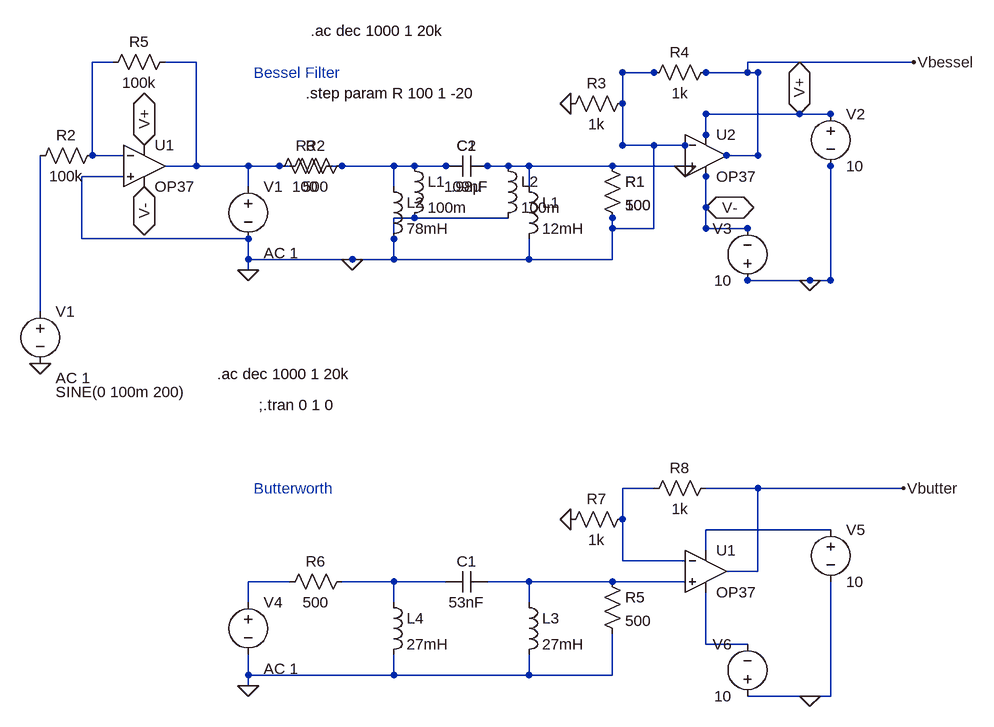
[diagram p0: schematic HighPass.asc]
HighPass.asc, the LTspice schematic file:
Version 4
<<<<<<< HEAD
SHEET 1 1036 680
WIRE -128 112 -160 112
WIRE 0 112 -48 112
WIRE 704 128 656 128
WIRE 864 128 784 128
WIRE 928 192 784 192
WIRE 976 192 928 192
WIRE 784 224 784 192
WIRE 656 240 656 128
WIRE 704 240 656 240
WIRE 752 240 704 240
WIRE -160 256 -160 112
WIRE -112 256 -160 256
WIRE 864 256 864 128
WIRE 864 256 816 256
WIRE 0 272 0 112
WIRE 0 272 -48 272
WIRE 128 272 0 272
WIRE 336 272 208 272
WIRE 384 272 336 272
WIRE 480 272 448 272
WIRE 640 272 480 272
WIRE -112 288 -176 288
WIRE 784 336 784 288
WIRE 336 352 304 352
WIRE 480 352 336 352
WIRE 640 368 640 352
WIRE 704 368 704 240
WIRE 704 368 640 368
WIRE 784 368 784 336
WIRE 848 368 784 368
WIRE -176 384 -176 288
WIRE 80 384 -176 384
WIRE 80 416 80 384
WIRE 240 416 80 416
WIRE 304 416 304 352
WIRE 304 416 240 416
WIRE 944 448 848 448
WIRE 976 448 976 272
WIRE 976 448 944 448
WIRE -240 496 -240 256
FLAG 240 416 0
FLAG 944 448 0
FLAG 928 192 V+
IOPIN 928 192 BiDir
FLAG 784 336 V-
IOPIN 784 336 BiDir
FLAG -80 240 V+
IOPIN -80 240 BiDir
FLAG -80 304 V-
IOPIN -80 304 BiDir
FLAG -240 576 0
FLAG 752 272 0
SYMBOL res 624 256 R0
SYMATTR InstName R1
SYMATTR Value 100
=======
SHEET 1 1200 1104
WIRE 1104 112 848 112
WIRE 704 128 656 128
WIRE 848 128 848 112
WIRE 848 128 784 128
WIRE 864 128 848 128
WIRE 656 176 656 128
WIRE 976 192 784 192
WIRE 784 224 784 192
WIRE 656 240 656 176
WIRE 752 240 656 240
WIRE 864 256 864 128
WIRE 864 256 816 256
WIRE 144 272 80 272
WIRE 304 272 224 272
WIRE 384 272 304 272
WIRE 512 272 448 272
WIRE 640 272 512 272
WIRE 752 272 640 272
WIRE 80 304 80 272
WIRE 304 304 304 272
WIRE 512 304 512 272
WIRE 784 368 784 288
WIRE 848 368 784 368
WIRE 80 416 80 384
WIRE 304 416 304 384
WIRE 304 416 80 416
WIRE 512 416 512 384
WIRE 512 416 304 416
WIRE 640 416 640 352
WIRE 640 416 512 416
WIRE 80 432 80 416
WIRE 944 448 848 448
WIRE 976 448 976 272
WIRE 976 448 944 448
WIRE 704 768 656 768
WIRE 864 768 784 768
WIRE 1088 768 864 768
WIRE 656 816 656 768
WIRE 976 832 784 832
WIRE 784 864 784 832
WIRE 656 880 656 816
WIRE 752 880 656 880
WIRE 864 896 864 768
WIRE 864 896 816 896
WIRE 144 912 80 912
WIRE 304 912 224 912
WIRE 384 912 304 912
WIRE 512 912 448 912
WIRE 640 912 512 912
WIRE 752 912 640 912
WIRE 80 944 80 912
WIRE 304 944 304 912
WIRE 512 944 512 912
WIRE 784 1008 784 928
WIRE 848 1008 784 1008
WIRE 80 1056 80 1024
WIRE 304 1056 304 1024
WIRE 304 1056 80 1056
WIRE 512 1056 512 1024
WIRE 512 1056 304 1056
WIRE 640 1056 640 992
WIRE 640 1056 512 1056
WIRE 80 1072 80 1056
WIRE 944 1088 848 1088
WIRE 976 1088 976 912
WIRE 976 1088 944 1088
FLAG 80 432 0
FLAG 576 176 0
FLAG 944 448 0
FLAG 80 1072 0
FLAG 576 816 0
FLAG 944 1088 0
FLAG 1104 112 Vbessel
FLAG 1088 768 Vbutter
SYMBOL cap 448 256 R90
WINDOW 0 0 32 VBottom 2
WINDOW 3 32 32 VTop 2
SYMATTR InstName C2
SYMATTR Value 109nF
SYMBOL ind 496 288 R0
SYMATTR InstName L1
SYMATTR Value 12mH
SYMBOL res 624 256 R0
SYMATTR InstName R1
SYMATTR Value 500
SYMBOL res 128 288 R270
WINDOW 0 32 56 VTop 2
WINDOW 3 0 56 VBottom 2
SYMATTR InstName R2
SYMATTR Value 500
SYMBOL voltage 80 288 R0
WINDOW 123 24 118 Left 2
SYMATTR Value2 AC 1
SYMATTR InstName V1
SYMATTR Value ""
SYMBOL res 560 192 R270
WINDOW 0 32 56 VTop 2
WINDOW 3 0 56 VBottom 2
SYMATTR InstName R3
SYMATTR Value 1k
>>>>>>> origin/master
SYMBOL res 688 144 R270
WINDOW 0 32 56 VTop 2
WINDOW 3 0 56 VBottom 2
SYMATTR InstName R4
<<<<<<< HEAD
SYMATTR Value {R}
=======
SYMATTR Value 1k
>>>>>>> origin/master
SYMBOL Opamps/OP37 784 192 R0
SYMATTR InstName U2
SYMBOL voltage 976 176 R0
SYMATTR InstName V2
SYMATTR Value 10
SYMBOL voltage 848 464 R180
WINDOW 0 24 96 Left 2
WINDOW 3 24 16 Left 2
SYMATTR InstName V3
SYMATTR Value 10
<<<<<<< HEAD
SYMBOL Opamps/OP37 -80 208 R0
SYMATTR InstName U1
SYMBOL res -144 240 R90
WINDOW 0 0 56 VBottom 2
WINDOW 3 32 56 VTop 2
SYMATTR InstName R2
SYMATTR Value 100k
SYMBOL res -32 96 R90
WINDOW 0 0 56 VBottom 2
WINDOW 3 32 56 VTop 2
SYMATTR InstName R5
SYMATTR Value 100k
SYMBOL voltage -240 480 R0
WINDOW 3 24 140 Left 2
WINDOW 123 24 118 Left 2
SYMATTR Value SINE(0 100m 200)
SYMATTR Value2 AC 1
SYMATTR InstName V1
SYMBOL cap 448 256 R90
WINDOW 0 0 32 VBottom 2
WINDOW 3 32 32 VTop 2
SYMATTR InstName C1
SYMATTR Value .98µ
SYMBOL ind 320 256 R0
SYMATTR InstName L1
SYMATTR Value 100m
SYMBOL ind 464 256 R0
SYMATTR InstName L2
SYMATTR Value 100m
SYMBOL res 224 256 R90
WINDOW 0 0 56 VBottom 2
WINDOW 3 32 56 VTop 2
SYMATTR InstName R3
SYMATTR Value 100
TEXT 176 64 Left 2 !.ac dec 1000 1 20k
TEXT 96 640 Left 2 !;.tran 0 1 0
TEXT 168 160 Left 2 !.step param R 100 1 -20
=======
SYMBOL ind 288 288 R0
SYMATTR InstName L2
SYMATTR Value 78mH
SYMBOL cap 448 896 R90
WINDOW 0 0 32 VBottom 2
WINDOW 3 32 32 VTop 2
SYMATTR InstName C1
SYMATTR Value 53nF
SYMBOL ind 496 928 R0
SYMATTR InstName L3
SYMATTR Value 27mH
SYMBOL res 624 896 R0
SYMATTR InstName R5
SYMATTR Value 500
SYMBOL res 128 928 R270
WINDOW 0 32 56 VTop 2
WINDOW 3 0 56 VBottom 2
SYMATTR InstName R6
SYMATTR Value 500
SYMBOL voltage 80 928 R0
WINDOW 123 24 118 Left 2
SYMATTR Value2 AC 1
SYMATTR InstName V4
SYMATTR Value ""
SYMBOL res 560 832 R270
WINDOW 0 32 56 VTop 2
WINDOW 3 0 56 VBottom 2
SYMATTR InstName R7
SYMATTR Value 1k
SYMBOL res 688 784 R270
WINDOW 0 32 56 VTop 2
WINDOW 3 0 56 VBottom 2
SYMATTR InstName R8
SYMATTR Value 1k
SYMBOL Opamps/OP37 784 832 R0
SYMATTR InstName U1
SYMBOL voltage 976 816 R0
SYMATTR InstName V5
SYMATTR Value 10
SYMBOL voltage 848 1104 R180
WINDOW 0 24 96 Left 2
WINDOW 3 24 16 Left 2
SYMATTR InstName V6
SYMATTR Value 10
SYMBOL ind 288 928 R0
SYMATTR InstName L4
SYMATTR Value 27mH
TEXT 32 592 Left 2 !.ac dec 1000 1 20k
TEXT 88 128 Left 2 ;Bessel Filter
TEXT 88 768 Left 2 ;Butterworth
>>>>>>> origin/master

The netlist it stands for:
* HighPass.asc
R1 0 0 100
C2 0 N003 109nF
L1 0 0 12mH
R1 0 0 500
R2 N002 N003 500
V1 N002 0 AC 1
R3 0 0 1k
R4 0 Vbessel 1k
XU2 0 0 V+ V- Vbessel LT1037  ; OP37, pins In+ In- V+ V- OUT
V2 V+ 0 10
V3 0 V- 10
XU1 0 N001 V+ V- N002 LT1037  ; OP37, pins In+ In- V+ V- OUT
R2 N001 N004 100k
R5 N002 N001 100k
V1 N004 0 SINE(0 100m 200) AC 1
C1 0 N003 .98µ
L1 N003 0 100m
L2 0 0 100m
R3 N003 N002 100
L2 N003 0 78mH
C1 N009 N008 53nF
L3 N009 0 27mH
R5 N009 0 500
R6 N007 N008 500
V4 N007 0 AC 1
R7 0 N005 1k
R8 N005 Vbutter 1k
XU1 N009 N005 N006 N010 Vbutter LT1037  ; OP37, pins In+ In- V+ V- OUT
V5 N006 0 10
V6 0 N010 10
L4 N008 0 27mH
.ac dec 1000 1 20k
;.tran 0 1 0
.step param R 100 1 -20
.ac dec 1000 1 20k
* Bessel Filter
* Butterworth
.lib LTC.lib
.backanno
.end